# EAGLE design ELE-T303 (EAGLE 4.11)
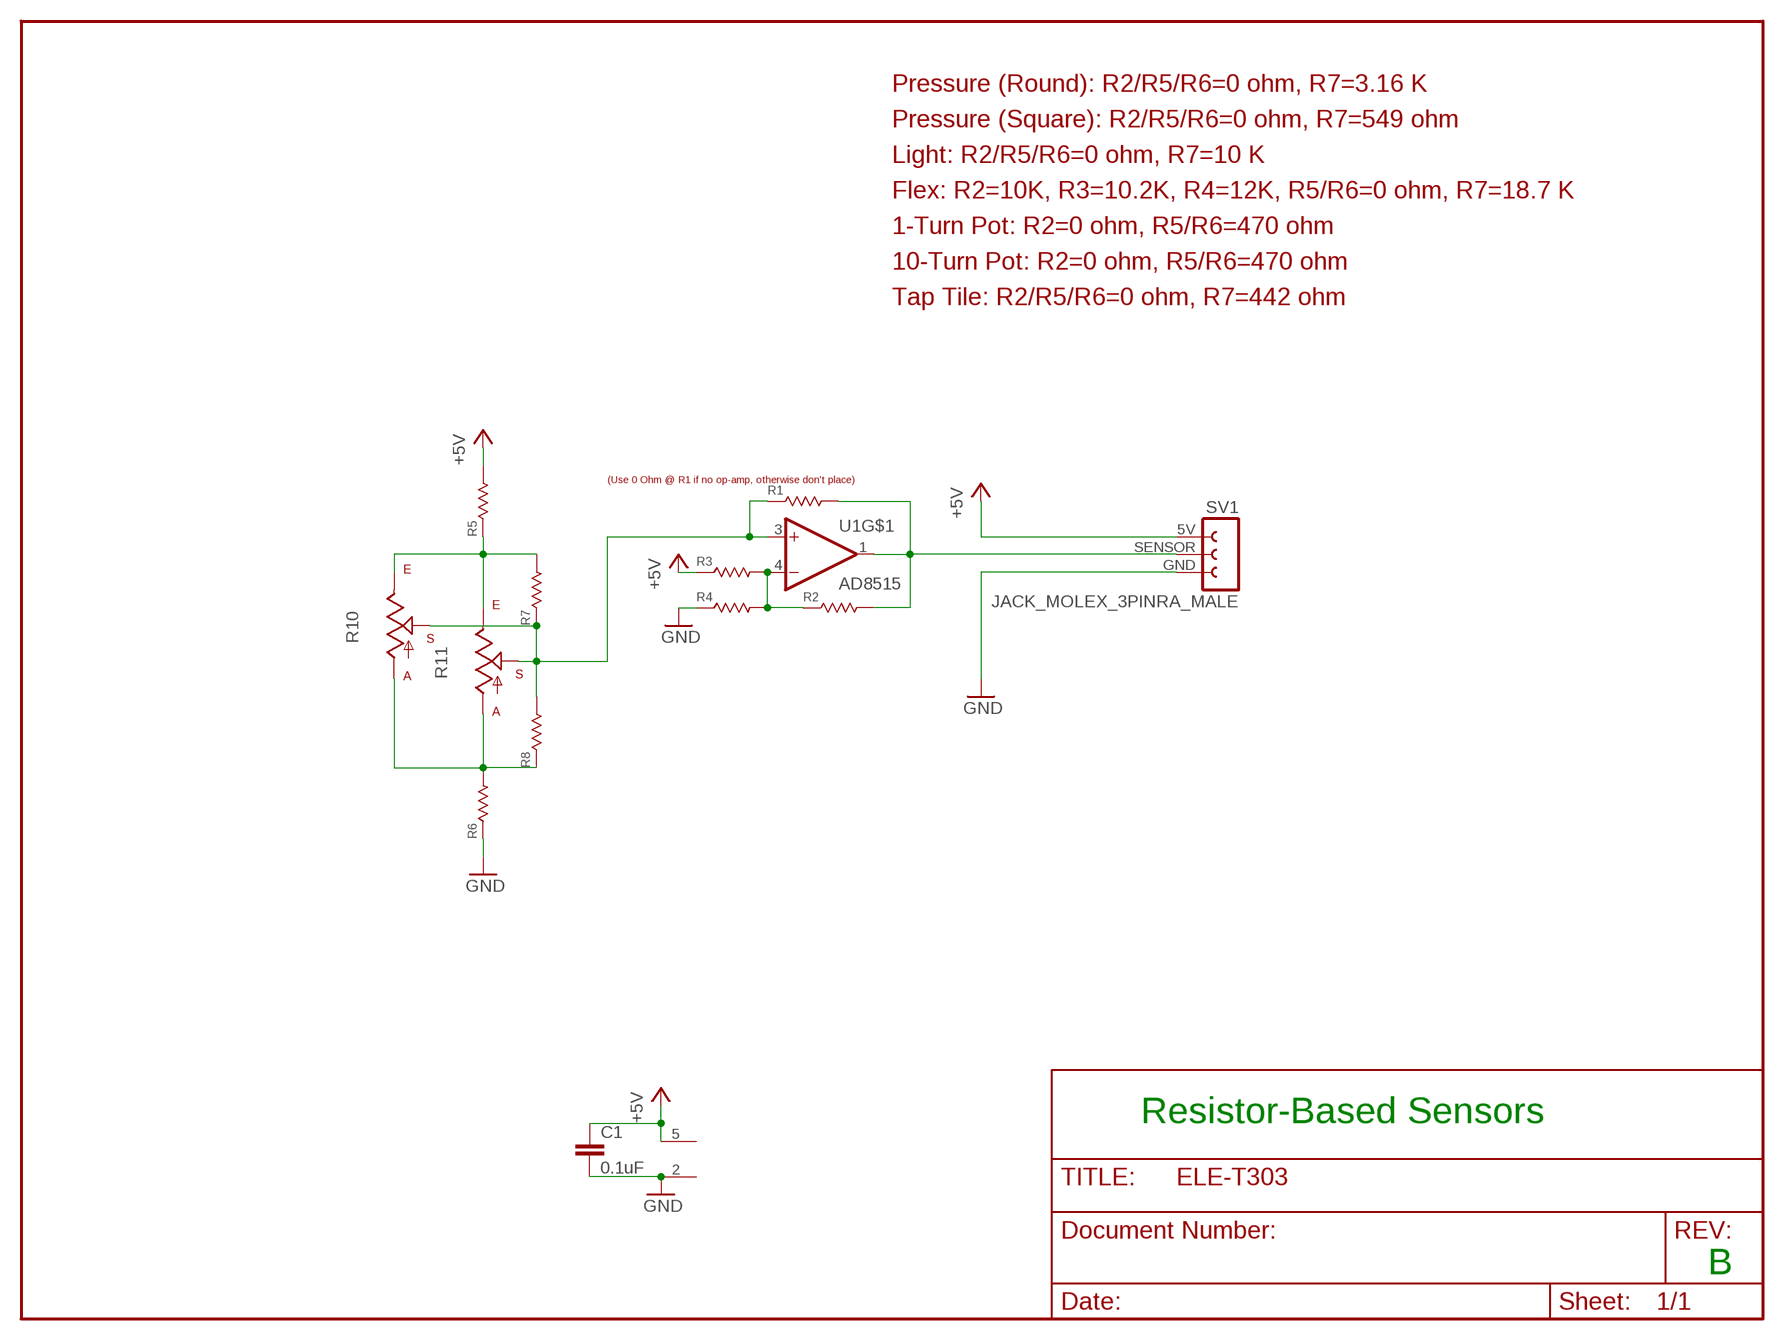
[diagram p0: schematic, sheet 1]

## Parts
C1  0.1uF  CAP_CERAMIC_0805_0603  [C0603]
R1  R-US_R0603  [R0603]
R2  R-US_R0603  [R0603]
R3  R-US_R0603  [R0603]
R4  R-US_R0603  [R0603]
R5  R-US_R0603  [R0603]
R6  R-US_R0603  [R0603]
R7  R-US_R0603  [R0603]
R8  R-US_R0603  [R0603]
R10  POT_10TURN  [POT_10TURN]
R11  POT_LIGHT_FLEX  [POT_LIGHT_FLEX]
SV1  JACK_MOLEX_3PINRA_MALE  [JACK_MOLEX_3PIN_RA]
U1  AD8515  [SOT23-5]

## Nets
+5V: C1.1 R3.1 R5.2 SV1.5V U1.5(V+)
GND: C1.2 R4.1 R6.1 SV1.GND U1.2(V-)
N$1: R5.1 R7.2 R10.3(E) R11.3(E)
N$2: R6.2 R8.1 R10.1(A) R11.1(A)
N$3: R1.2 R2.2 SV1.SENSOR U1.1(OUT)
N$4: R2.1 R3.2 R4.2 U1.4(-IN)
N$5: R1.1 R7.1 R8.2 R10.2(WIPER)(S) R11.2(WIPER)(S) U1.3(+IN)

## Notes on the sheet
- Pressure (Round): R2/R5/R6=0 ohm, R7=3.16 K
- Pressure (Square): R2/R5/R6=0 ohm, R7=549 ohm
- Light: R2/R5/R6=0 ohm, R7=10 K
- Flex: R2=10K, R3=10.2K, R4=12K, R5/R6=0 ohm, R7=18.7 K
- 1-Turn Pot: R2=0 ohm, R5/R6=470 ohm
- 10-Turn Pot: R2=0 ohm, R5/R6=470 ohm
- Tap Tile: R2/R5/R6=0 ohm, R7=442 ohm
- (Use 0 Ohm @ R1 if no op-amp, otherwise don't place)
- Resistor-Based Sensors
- B

## Library data of the parts
C1 = TEABOX-LIB:CAP_CERAMIC_0805
R1-R8 = rcl:R-US_: RESISTOR, American symbol
R10 = SENSORPARTS:POT_10TURN
R11 = SENSORPARTS:POT_LIGHT_FLEX
SV1 = TEABOX-LIB:JACK_MOLEX_3PIN
U1 = TEABOX-LIB:AD8515

## Board
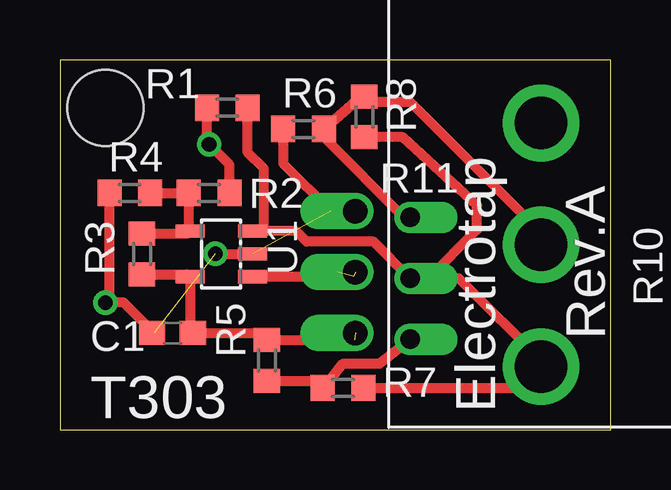
[diagram p1: board, top side]
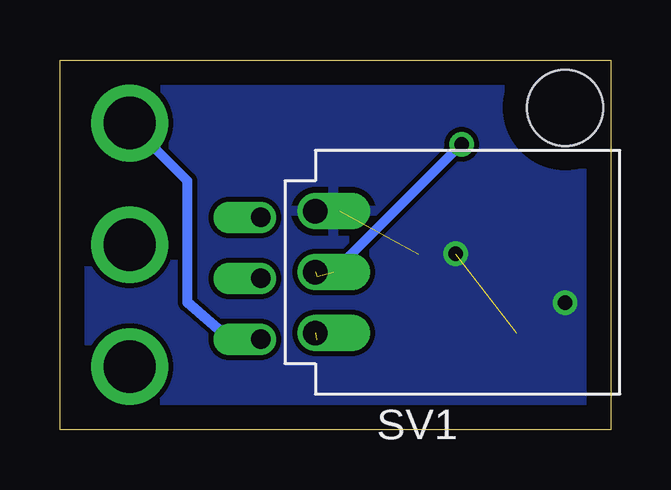
[diagram p2: board, bottom side, seen from below]

Size 22.97 x 15.42 mm. Coordinates in mm from the lower left corner, seen from the top.
Outline: 0,0 22.97,0 22.97,15.42 0,15.42 0,0
Copper layers (1*16): Top 0.035mm / dielectric 1.5mm / Bottom 0.035mm
Design rules "default": minimum track width 10mil, minimum drill 24mil, track to track 8mil, track to pad 8mil, pad to pad 8mil, via to via 8mil, smd to smd 8mil, copper to edge 40mil, drill to drill 8mil, minimum pad ring 10mil, minimum via ring 8mil, stop-mask expansion 4mil, vias tented up to drill 0mil, thermal gap 10mil
Holes 3.17 mm at 1.9,13.42

### Footprints (pad centres in the part's own frame; a part is rotated, then mirrored left to right if it is on the bottom)
C0603 = smd 1.1 x 1: 1 -0.85,0; 2 0.85,0
R0603 = smd 1 x 1.1: 1 -0.85,0; 2 0.85,0
POT_10TURN = drill 2.184 round: 1 5.08,6.35; 2(WIPER) 0,6.35; 3 10.16,6.35
POT_LIGHT_FLEX = drill 0.813 offset: 1 -2.54,1.27; 2(WIPER) 0,1.27; 3 2.54,1.27
JACK_MOLEX_3PIN_RA = drill 1.016 offset: 5V 0,0; GND 0,5.08; SENSOR 0,2.54
SOT23-5 = smd 0.55 x 1.2: 1 -0.95,-1.3; 2 0,-1.3; 3 0.95,-1.3; 4 0.95,1.3; 5 -0.95,1.3

### Placement (x,y rotation side)
C1  4.69,4.03 180 top
R1  6.98,13.42 180 top
R2  6.22,9.87 0 top
R3  3.42,7.33 90 top
R4  2.92,9.87 0 top
R5  8.63,2.88 90 top
R6  10.15,12.54 0 top
R7  11.81,1.74 180 top
R8  12.7,13.04 270 top
R10  26.41,2.63 90 top
R11  13.33,6.31 270 top
SV1  12.31,4.03 0 bottom
U1  6.73,7.33 90 top

### Tracks (layer width: path | path; a pad name or v marks a point on that pad's centre or on a via)
+5V  (1 unrouted)
  Top 0.406: 12.28,3.73 R5.2 8.54,3.73 8.25,4.03 C1.1 5.46,4.03 5.43,4.06 U1.5 5.43,6.34 | 5.43,6.34 5.46,6.31 | R3.1 5.29,6.48 5.43,6.34
GND  (via drill 0.61)  (2 unrouted)
  Top 0.406: R4.1 2.07,5.46 v1.9,5.3 2.66,5.3 3.93,4.03 C1.2 | v6.47,7.33 U1.2 | R6.1 9.3,11.1 11.3,9.11 SV1.GND
  pour Bottom: 0.12,15.46 22.98,15.46 22.98,-0.04 0.12,-0.04
N$1
  Top 0.406: R11.3 13.33,2.76 11.81,2.76 10.96,1.65 R7.2 11.04,1.49 10.5,2.03 R5.1
  Bottom 0.406: R11.3 15.87,3.77 17.65,5.3 17.65,10.38 R10.3
N$2
  Top 0.406: R10.1 20.06,8.22 14.6,13.68 12.82,13.68 12.7,13.8 R8.1 12.61,13.89 12.57,13.93 12.19,13.55 R6.2 11,12.19 14.35,8.85 R11.1
N$3  (via drill 0.61)  (2 unrouted)
  Top 0.406: U1.1 12.25,6.38 | R1.2 6.13,11.99 v6.22,11.9 7.07,11.05 R2.2
  Bottom 0.406: v6.22,11.9 11.55,6.57
N$4
  Top 0.406: R3.2 5.29,8.18 5.43,8.31 | R4.2 R2.1 5.37,8.43 5.46,8.34 5.43,8.31 | 5.43,8.31 U1.4
N$5
  Top 0.406: R8.2 14.31,12.19 17.39,9.36 17.39,8.34 15.36,6.31 | 15.36,6.31 R11.2(WIPER) 13.08,7.84 10.28,7.84 9.84,8.28 8.5,8.28 | 20.19,2.76 R10.2(WIPER) | R7.1 18.92,1.74 20.19,2.76 | 15.36,6.31 16.63,6.31 20.19,2.76 | 8.5,8.28 U1.3 | R1.1 7.83,11.56 8.5,10.88 8.5,8.28

### Text on the board
tPlace: Rev.A | T303 | Electrotap